# Altium schematic sheet Main.SchDoc
size A; SheetNumber: 1; SheetTotal: 6
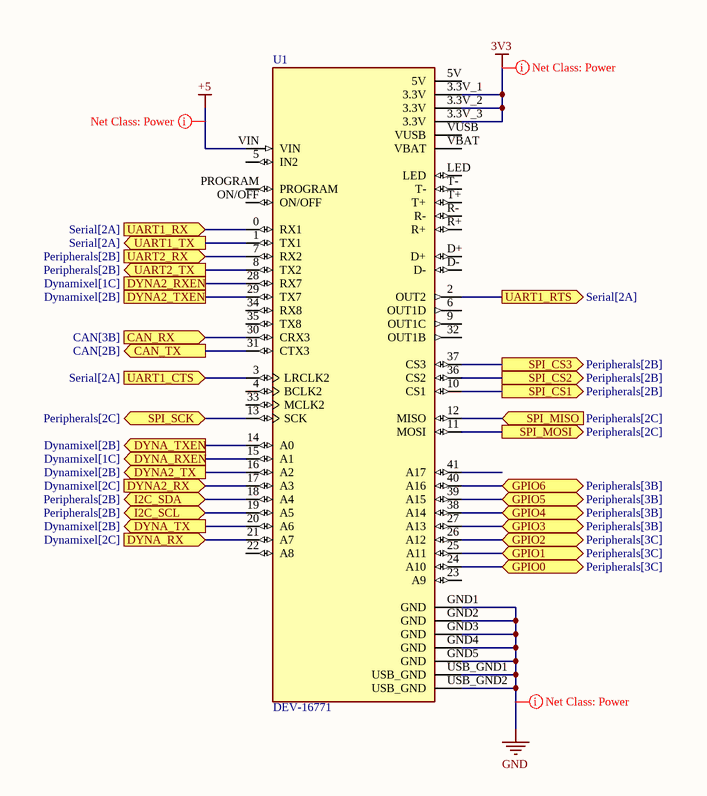
[diagram p0: Main.SchDoc]

## Parts
U1  DEV-16771  [MODULE_DEV-16771]

## Ports
CAN_RX (in, see CAN[3B]), CAN_TX (out, see CAN[2B]), DYNA2_RX (in, see Dynamixel[2C]), DYNA2_RXEN (see Dynamixel[1C]), DYNA2_TX (out, see Dynamixel[2B]), DYNA2_TXEN (see Dynamixel[2B]), DYNA_RX (in, see Dynamixel[2C]), DYNA_RXEN (out, see Dynamixel[1C]), DYNA_TX (out, see Dynamixel[2B]), DYNA_TXEN (out, see Dynamixel[2B]), GPIO0 (bidir, see Peripherals[3C]), GPIO1 (bidir, see Peripherals[3C]), GPIO2 (bidir, see Peripherals[3C]), GPIO3 (bidir, see Peripherals[3B]), GPIO4 (bidir, see Peripherals[3B]), GPIO5 (bidir, see Peripherals[3B]), GPIO6 (bidir, see Peripherals[3B]), I2C_SCL (bidir, see Peripherals[2B]), I2C_SDA (bidir, see Peripherals[2B]), SPI_CS1 (out, see Peripherals[2B]), SPI_CS2 (out, see Peripherals[2B]), SPI_CS3 (out, see Peripherals[2B]), SPI_MISO (in, see Peripherals[2C]), SPI_MOSI (out, see Peripherals[2C]), SPI_SCK (bidir, see Peripherals[2C]), UART1_CTS (in, see Serial[2A]), UART1_RTS (out, see Serial[2A]), UART1_RX (in, see Serial[2A]), UART1_TX (out, see Serial[2A]), UART2_RX (in, see Peripherals[2B]), UART2_TX (out, see Peripherals[2B])

## Nets
3V3: U1.3.3V_1(3.3V) U1.3.3V_2(3.3V) U1.3.3V_3(3.3V)
+5: U1.VIN
GND: U1.GND1(GND) U1.GND2(GND) U1.GND3(GND) U1.GND4(GND) U1.GND5(GND) U1.USB_GND1(USB_GND) U1.USB_GND2(USB_GND)
CAN_RX: U1.30(CRX3) ; port CAN_RX
CAN_TX: U1.31(CTX3) ; port CAN_TX
DYNA2_RX: U1.17(A3) ; port DYNA2_RX
DYNA2_RXEN: U1.28(RX7) ; port DYNA2_RXEN
DYNA2_TX: U1.16(A2) ; port DYNA2_TX
DYNA2_TXEN: U1.29(TX7) ; port DYNA2_TXEN
DYNA_RX: U1.21(A7) ; port DYNA_RX
DYNA_RXEN: U1.15(A1) ; port DYNA_RXEN
DYNA_TX: U1.20(A6) ; port DYNA_TX
DYNA_TXEN: U1.14(A0) ; port DYNA_TXEN
GPIO0: U1.24(A10) ; port GPIO0
GPIO1: U1.25(A11) ; port GPIO1
GPIO2: U1.26(A12) ; port GPIO2
GPIO3: U1.27(A13) ; port GPIO3
GPIO4: U1.38(A14) ; port GPIO4
GPIO5: U1.39(A15) ; port GPIO5
GPIO6: U1.40(A16) ; port GPIO6
I2C_SCL: U1.19(A5) ; port I2C_SCL
I2C_SDA: U1.18(A4) ; port I2C_SDA
SPI_CS1: U1.10(CS1) ; port SPI_CS1
SPI_CS2: U1.36(CS2) ; port SPI_CS2
SPI_CS3: U1.37(CS3) ; port SPI_CS3
SPI_MISO: U1.12(MISO) ; port SPI_MISO
SPI_MOSI: U1.11(MOSI) ; port SPI_MOSI
SPI_SCK: U1.13(SCK) ; port SPI_SCK
UART1_CTS: U1.3(LRCLK2) ; port UART1_CTS
UART1_RTS: U1.2(OUT2) ; port UART1_RTS
UART1_RX: U1.0(RX1) ; port UART1_RX
UART1_TX: U1.1(TX1) ; port UART1_TX
UART2_RX: U1.7(RX2) ; port UART2_RX
UART2_TX: U1.8(TX2) ; port UART2_TX

Not connected (* = marked no-connect by the designer): U1 4(BCLK2) 5(IN2) 5V 6(OUT1D) 9(OUT1C) 22(A8) 23(A9) 32(OUT1B) 33(MCLK2) 34(RX8) 35(TX8) 41(A17) D+ D- LED ON/OFF PROGRAM R+ R- T+ T- VBAT VUSB

## Layout directives
net class Power: 3V3, +5, GND

## Library data of the parts
U1 = DEV-16771: RT1062 Teensy 4.1 i.MX ARM Cortex-M7 MPU Embedded Evaluation Board; MF: {'manufacturer': u'SparkFun Electronics'}; Package: None; Availability: Unavailable; Value: *; MP: DEV-16771; Price: None